# Altium schematic sheet control.SchDoc: Control
size A4; Organization: GPA Robotics; DocumentNumber: 2; Revision: REV 0; SheetNumber: 2; SheetTotal: 11
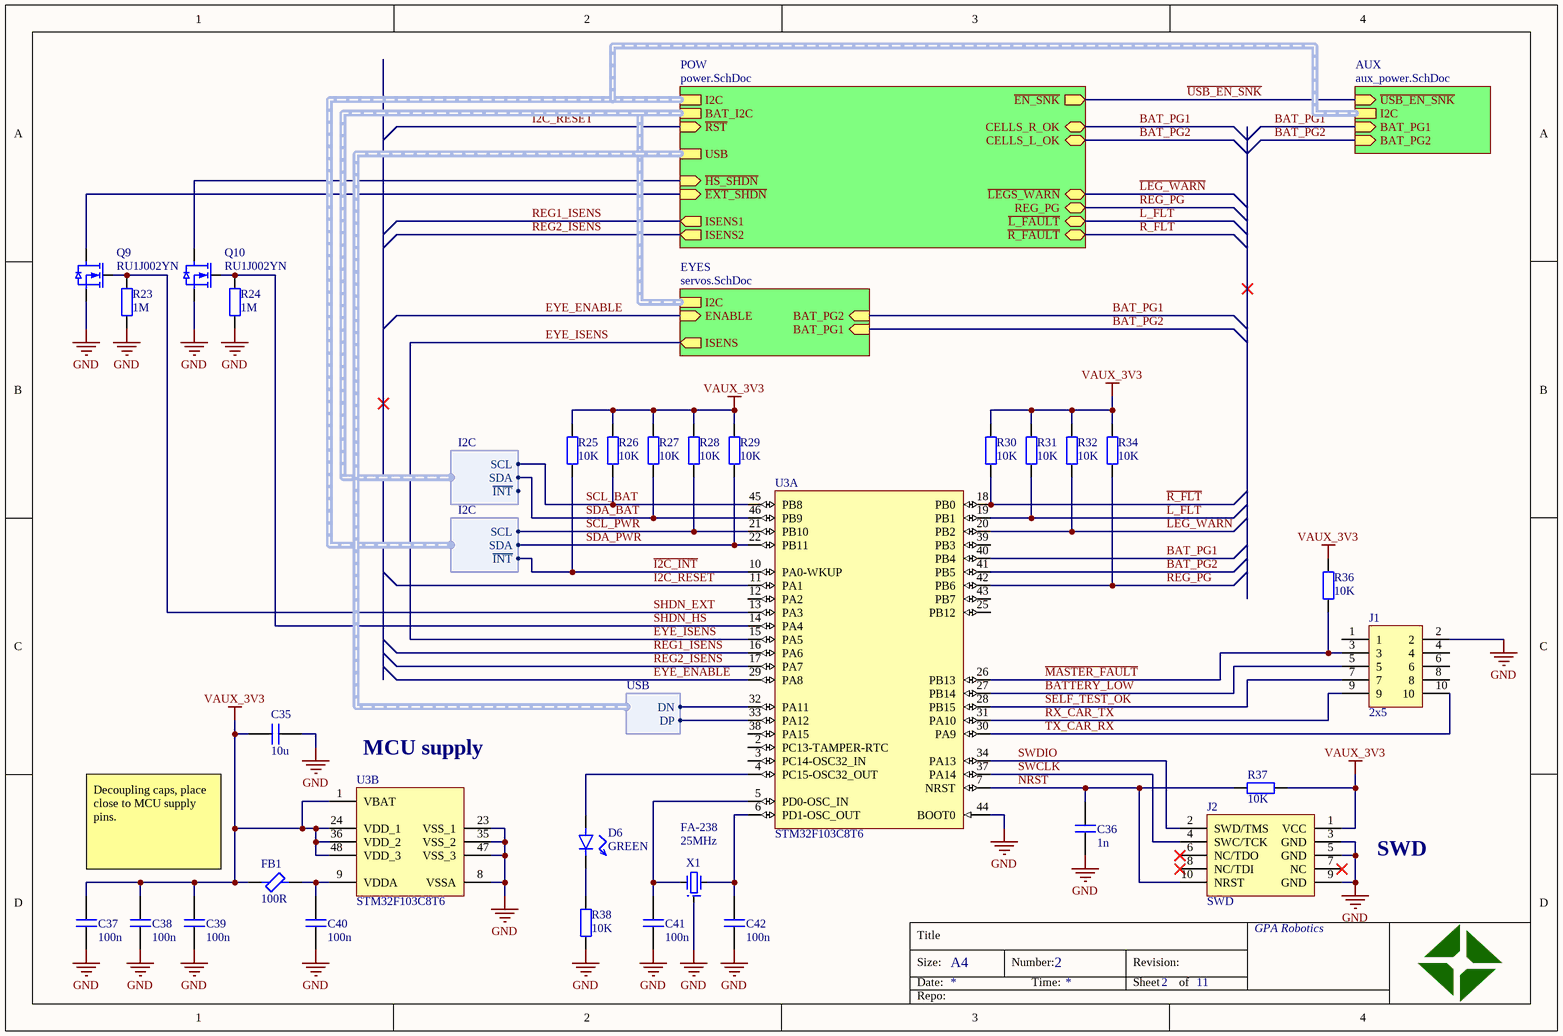
[diagram p0: control.SchDoc]

## Parts
C35  value 10u  [CAPC3216X14N]  (hidden comment: cap)
C36  value 1n  [CAPC1005X06N]  (hidden comment: cap)
C37  value 100n  [CAPC1005X06N]  (hidden comment: cap)
C38  value 100n  [CAPC1005X06N]  (hidden comment: cap)
C39  value 100n  [CAPC1005X06N]  (hidden comment: cap)
C40  value 100n  [CAPC1005X06N]  (hidden comment: cap)
C41  value 100n  [CAPC1005X06N]  (hidden comment: cap)
C42  value 100n  [CAPC1005X06N]  (hidden comment: cap)
D6  value GREEN  [CAPCP1005X06N]  (hidden comment: led)
FB1  value 100R  [INDC1005X06N]  (hidden comment: ferrite)
J1  2x5  [hdr_2x5_50mil]
J2  SWD  [hdr_2x5_50mil]
Q9  RU1J002YN  [SOTFL65P210X105-3N]
Q10  RU1J002YN  [SOTFL65P210X105-3N]
R23  value 1M  [RESC1005X04N]  (hidden comment: res)
R24  value 1M  [RESC1005X04N]  (hidden comment: res)
R25  value 10K  [RESC1005X04N]  (hidden comment: res)
R26  value 10K  [RESC1005X04N]  (hidden comment: res)
R27  value 10K  [RESC1005X04N]  (hidden comment: res)
R28  value 10K  [RESC1005X04N]  (hidden comment: res)
R29  value 10K  [RESC1005X04N]  (hidden comment: res)
R30  value 10K  [RESC1005X04N]  (hidden comment: res)
R31  value 10K  [RESC1005X04N]  (hidden comment: res)
R32  value 10K  [RESC1005X04N]  (hidden comment: res)
R34  value 10K  [RESC1005X04N]  (hidden comment: res)
R36  value 10K  [RESC1005X04N]  (hidden comment: res)
R37  value 10K  [RESC1005X04N]  (hidden comment: res)
R38  value 10K  [RESC1005X04N]  (hidden comment: res)
U3  STM32F103C8T6  [STM-LQFP48_N]  (parts A,B of 2)
X1  FA-238  freq: 25MHz  [DFN220P320X70-4N]

## Sub-sheets
AUX = aux_power.SchDoc: BAT_PG2 (in), BAT_PG1 (in), ~{USB_EN_SNK} (in), I2C (harness I2C)
EYES = servos.SchDoc: ISENS (out), BAT_PG2 (in), BAT_PG1 (in), I2C (harness I2C), ENABLE (in)
POW = power.SchDoc: ~{RST} (in), ~{HS_SHDN} (in), CELLS_R_OK (bidir), ~{LEGS_WARN} (bidir), CELLS_L_OK (bidir), ~{L_FAULT} (bidir), ~{R_FAULT} (bidir), ~{EN_SNK} (out), I2C (harness I2C), BAT_I2C (harness I2C), ~{EXT_SHDN} (in), ISENS1 (out), ISENS2 (out), REG_PG (bidir), USB (harness USB)

## Harnesses
I2C: SDA, SCL, ~{INT}
USB: DP, DN

## Nets
GND: C35.2 C36.1 C37.1 C38.1 C39.1 C40.1 C41.1 C42.1 J1.2 J2.3(GND) J2.5(GND) J2.9(GND) Q9.2(S) Q10.2(S) R23.1 R24.1 R38.1 U3.8(VSSA) U3.23(VSS_1) U3.35(VSS_2) U3.44(BOOT0) U3.47(VSS_3) X1.SHIELD
VAUX_3V3: C35.1 C37.2 C38.2 C39.2 FB1.1 J2.1(VCC) R25.2 R26.2 R27.2 R28.2 R29.2 R30.2 R31.2 R32.2 R34.2 R36.2 R37.1 U3.1(VBAT) U3.24(VDD_1) U3.36(VDD_2) U3.48(VDD_3)
~{BATTERY_LOW}: J1.5 U3.27(PB14)
~{I2C_INT}: R25.1 U3.10(PA0-WKUP) ; sheet POW/I2C.~{INT}
~{L_FLT}: R31.1 U3.19(PB1) ; sheet POW/~{L_FAULT}
~{LEG_WARN}: R32.1 U3.20(PB2) ; sheet POW/~{LEGS_WARN}
~{MASTER_FAULT}: J1.3 R36.1 U3.26(PB13)
~{R_FLT}: R30.1 U3.18(PB0) ; sheet POW/~{R_FAULT}
~{USB_EN_SNK}: sheet POW/~{EN_SNK}, sheet AUX/~{USB_EN_SNK}
BAT_PG1: U3.40(PB4) ; sheet POW/CELLS_R_OK, sheet AUX/BAT_PG1, sheet EYES/BAT_PG2
BAT_PG2: U3.41(PB5) ; sheet POW/CELLS_L_OK, sheet AUX/BAT_PG2, sheet EYES/BAT_PG1
EYE_ENABLE: U3.29(PA8) ; sheet EYES/ENABLE
EYE_ISENS: U3.15(PA5) ; sheet EYES/ISENS
I2C_RESET: U3.11(PA1) ; sheet POW/~{RST}
NRST: C36.2 J2.10(NRST) R37.2 U3.7(NRST)
REG1_ISENS: U3.16(PA6) ; sheet POW/ISENS1
REG2_ISENS: U3.17(PA7) ; sheet POW/ISENS2
REG_PG: R34.1 U3.42(PB6) ; sheet POW/REG_PG
RX_CAR_TX: J1.9 U3.31(PA10)
SCL_BAT: R26.1 U3.45(PB8) ; sheet POW/BAT_I2C.SCL
SCL_PWR: R28.1 U3.21(PB10) ; sheet POW/I2C.SCL
SDA_BAT: R27.1 U3.46(PB9) ; sheet POW/BAT_I2C.SDA
SDA_PWR: R29.1 U3.22(PB11) ; sheet POW/I2C.SDA
SELF_TEST_OK: J1.7 U3.28(PB15)
SHDN_EXT: Q9.1(G) R23.2 U3.13(PA3)
SHDN_HS: Q10.1(G) R24.2 U3.14(PA4)
SWCLK: J2.4(SWC/TCK) U3.37(PA14)
SWDIO: J2.2(SWD/TMS) U3.34(PA13)
TX_CAR_RX: J1.10 U3.30(PA9)
NetC40_2: C40.2 FB1.2 U3.9(VDDA)
NetC41_2: C41.2 U3.5(PD0-OSC_IN) X1.1
NetC42_2: C42.2 U3.6(PD1-OSC_OUT) X1.2
NetD6_A: D6.A U3.4(PC15-OSC32_OUT)
NetD6_C: D6.C R38.2
NetQ9_3: Q9.3(D) ; sheet POW/~{EXT_SHDN}
NetQ10_3: Q10.3(D) ; sheet POW/~{HS_SHDN}
NetU3_32: U3.32(PA11) ; sheet POW/USB.DN
NetU3_33: U3.33(PA12) ; sheet POW/USB.DP

Not connected (* = marked no-connect by the designer): J1 1 4 6 8; J2 6(NC/TDO)* 7(NC)* 8(NC/TDI)*; U3 2(PC13-TAMPER-RTC) 3(PC14-OSC32_IN) 12(PA2) 25(PB12) 38(PA15) 39(PB3) 43(PB7)

## Buses and harness runs
harness sheet AUX/I2C = sheet POW/I2C
harness sheet EYES/I2C = sheet POW/BAT_I2C

## Notes on the sheet
- (near U3) MCU supply
- SWD
- Decoupling caps, place close to MCU supply pins.
- Title
- Size:
- Date:
- A4
- Number:
- Time:
- Revision:
- Sheet
- of
- Repo:

## Library data of the parts
C35-C42 = cap: Capacitor; voltage: *; type: *; #digikey: *; #mouser: *
D6 = led: pin to pad: A>1 C>2
FB1 = ferrite: Inductor; #digikey: *; #mouser: *
J1 = hdr_2x5: 2x5 Header
J2 = hdr_swd: SWD Header
Q9 Q10 = ru1j002yn: N-channel 50V 200mA Small signal MOSFET; ComponentLink1Description: datasheet; ComponentLink1URL: https://www.mouser.se/datasheet/2/348/ru1j002yn-e-1018335.pdf
R23-R32 R34 R36-R38 = res: Resistor; power: *; voltage: *; #digikey: *; #mouser: *
U3 = STM32F103C8T6: ARM Cortex-M3 32-bit MCU, 64 KB Flash, 20 KB Internal RAM, 37 I/Os, 48-pin LQFP, -40 to 85 degC, Tray; A/D Converter: 2x12-bit (10 Channel); FLASH Size (Prog) (kB): 64; I/Os (High Current): 37; Internal RAM Size (kB): 20; Operating Frequency(F) (Processor speed) (MHz): 72; Supply Voltage(Vcc) min (V): 2; DatasheetVersion: Rev. 16; PackageVersion: Rev. 6, 06/2013; PackageReference: LQFP48; PackageDescription: 48-Pin Low Profile Quad Flat Package, 7 x 7 mm Body, 0.5 mm Pitch; Supplier 1: Digi-Key; Supplier Part Number 1: 497-6063-ND; Supplier 2: Farnell; Supplier Part Number 2: 1447637; Supplier 3: Newark; Supplier Part Number 3: 59M2182; Supplier 4: Newark; Supplier Part Number 4: 57P1222; Supplier 5: Mouser; Supplier Part Number 5: 511-STM32F103C8T6; Core: ARM Cortex-M3; Packing: Tray; Mounting Technology: Surface Mount; PartNumber: STM32F103C8T6; ComponentLink1Description: Manufacturer URL; ComponentLink1URL: http://www.st.com/web/en/home.html; ComponentLink2Description: Datasheet; ComponentLink2URL: http://www.st.com/st-web-ui/static/active/en/resource/technical/document/datasheet/CD00161566.pdf; ComponentLink3Description: Package Specification; ComponentLink3URL: http://www.st.com/st-web-ui/static/active/en/resource/technical/document/datasheet/DM00058181.pdf
X1 = crystal: Crystal With Shield; #digikey: *; #mouser: *